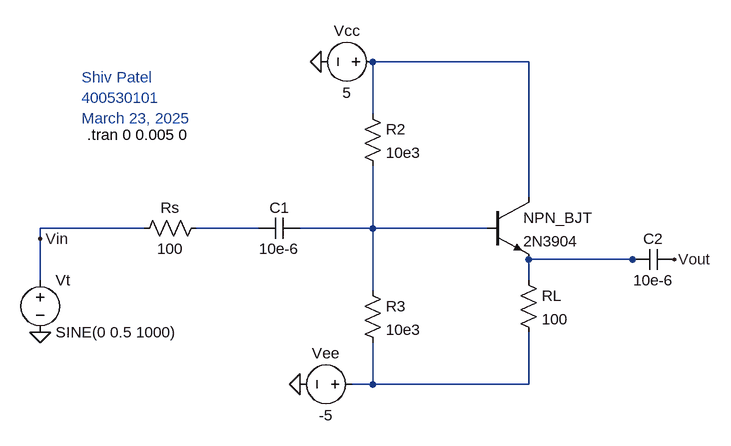
[diagram p0: schematic 2EI4_Project3.asc]
2EI4_Project3.asc, the LTspice schematic file:
Version 4
SHEET 1 1108 680
WIRE 816 -48 576 -48
WIRE 576 32 576 -48
WIRE 816 160 816 -48
WIRE 224 208 64 208
WIRE 400 208 304 208
WIRE 576 208 576 112
WIRE 576 208 464 208
WIRE 752 208 576 208
WIRE 64 224 64 208
WIRE 976 256 816 256
WIRE 992 256 976 256
WIRE 64 288 64 224
WIRE 816 288 816 256
WIRE 576 304 576 208
WIRE 576 448 576 384
WIRE 576 448 544 448
WIRE 816 448 816 368
WIRE 816 448 576 448
FLAG 64 368 0
FLAG 496 -48 0
FLAG 1040 256 Vout
FLAG 464 448 0
FLAG 64 224 Vin
SYMBOL voltage 64 272 R0
SYMATTR InstName Vt
SYMATTR Value SINE(0 0.5 1000)
SYMBOL Res 320 192 R90
WINDOW 0 0 56 VBottom 2
WINDOW 3 32 56 VTop 2
SYMATTR InstName Rs
SYMATTR Value 100
SYMBOL Cap 464 192 R90
WINDOW 0 0 32 VBottom 2
WINDOW 3 32 32 VTop 2
SYMATTR InstName C1
SYMATTR Value 10e-6
SYMBOL Res 560 16 R0
SYMATTR InstName R2
SYMATTR Value 10e3
SYMBOL Res 560 288 R0
SYMATTR InstName R3
SYMATTR Value 10e3
SYMBOL Voltage 592 -48 R90
WINDOW 0 -32 56 VBottom 2
WINDOW 3 32 56 VTop 2
SYMATTR InstName Vcc
SYMATTR Value 5
SYMBOL npn 752 160 R0
SYMATTR InstName NPN_BJT
SYMATTR Value 2N3904
SYMBOL Cap 1040 240 R90
WINDOW 0 0 32 VBottom 2
WINDOW 3 32 32 VTop 2
SYMATTR InstName C2
SYMATTR Value 10e-6
SYMBOL Res 800 272 R0
SYMATTR InstName RL
SYMATTR Value 100
SYMBOL Voltage 560 448 R90
WINDOW 0 -32 56 VBottom 2
WINDOW 3 32 56 VTop 2
SYMATTR InstName Vee
SYMATTR Value -5
TEXT 128 -24 Left 2 ;Shiv Patel\n400530101\nMarch 23, 2025
TEXT 136 64 Left 2 !.tran 0 0.005 0

The netlist it stands for:
* 2EI4_Project3.asc
Vt Vin 0 SINE(0 0.5 1000)
Rs N002 Vin 100
C1 N003 N002 10e-6
R2 N001 N003 10e3
R3 N003 N005 10e3
Vcc N001 0 5
Q§NPN_BJT N001 N003 N004 0 2N3904
C2 Vout N004 10e-6
RL N004 N005 100
Vee N005 0 -5
.model NPN NPN
.model PNP PNP
.lib standard.bjt
* Shiv Patel
* 400530101
* March 23, 2025
.tran 0 0.005 0
.backanno
.end